# EAGLE design diffren amp (EAGLE 9.5.2)
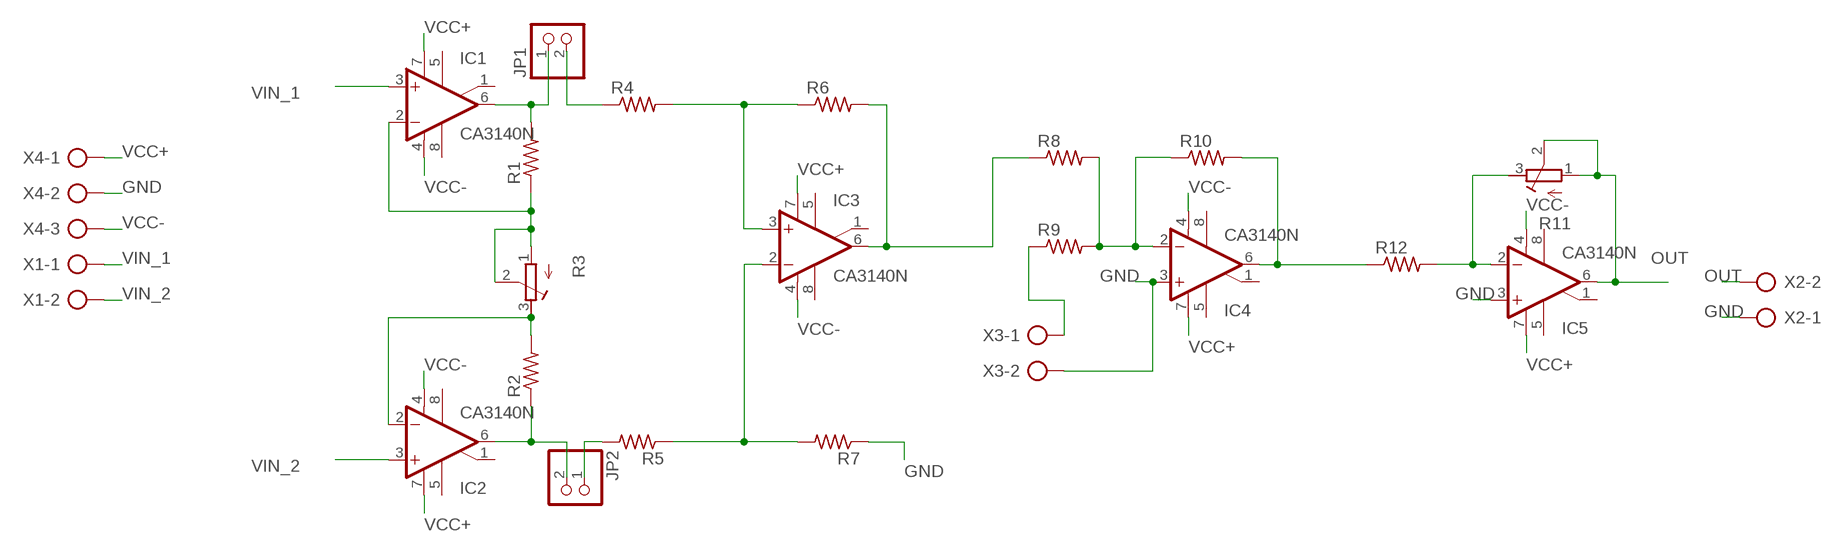
[diagram p0: schematic, sheet 1]

## Parts
IC1  CA3140N  [DIL08]
IC2  CA3140N  [DIL08]
IC3  CA3140N  [DIL08]
IC4  CA3140N  [DIL08]
IC5  CA3140N  [DIL08]
JP1  PINHD-1X2  [1X02]
JP2  PINHD-1X2  [1X02]
R1  R-US_0309/12  [0309/12]
R2  R-US_0309/12  [0309/12]
R3  R-TRIMM64W  [RTRIM64W]
R4  R-US_0309/12  [0309/12]
R5  R-US_0309/12  [0309/12]
R6  R-US_0309/12  [0309/12]
R7  R-US_0309/12  [0309/12]
R8  R-US_0309/12  [0309/12]
R9  R-US_0309/12  [0309/12]
R10  R-US_0309/12  [0309/12]
R11  R-TRIMM64W  [RTRIM64W]
R12  R-US_0309/12  [0309/12]
X1  AK300/2  [AK300/2]
X2  AK500/2-H  [AK500/2-H]
X3  AK500/2-H  [AK500/2-H]
X4  AK300/3  [AK300/3]

## Nets
GND: IC4.3(+IN) IC5.3(+IN) R7.1 X2.1 X3.2 X4.2
N$1: IC1.6(OUT) JP1.1 R1.2
N$2: IC2.6(OUT) JP2.2 R2.1
N$3: IC2.2(-IN) R2.2 R3.3(E)
N$4: IC1.2(-IN) R1.1 R3.1(A) R3.2(S)
N$5: IC3.2(-IN) R5.1 R7.2
N$6: IC3.3(+IN) R4.2 R6.1
N$7: JP1.2 R4.1
N$8: JP2.1 R5.2
N$9: IC4.2(-IN) R8.2 R9.2 R10.1
N$10: IC4.6(OUT) R10.2 R12.1
N$11: R9.1 X3.1
N$12: IC5.2(-IN) R11.3(E) R12.2
OUT: IC3.6(OUT) IC5.6(OUT) R6.2 R8.1 R11.1(A) R11.2(S) X2.2
VCC+: IC1.7(V+) IC2.7(V+) IC3.7(V+) IC4.7(V+) IC5.7(V+) X4.1
VCC-: IC1.4(V-) IC2.4(V-) IC3.4(V-) IC4.4(V-) IC5.4(V-) X4.3
VIN_1: IC1.3(+IN) X1.1
VIN_2: IC2.3(+IN) X1.2
Unconnected: IC1.1(ON/CMP) IC1.5(ON) IC1.8(CMP) IC2.1(ON/CMP) IC2.5(ON) IC2.8(CMP) IC3.1(ON/CMP) IC3.5(ON) IC3.8(CMP) IC4.1(ON/CMP) IC4.5(ON) IC4.8(CMP) IC5.1(ON/CMP) IC5.5(ON) IC5.8(CMP)

## Library data of the parts
IC1-IC5 = linear:CA3140: OP AMP
JP1 JP2 = pinhead:PINHD-1X2: PIN HEADER
R1 R2 R4-R10 R12 = rcl:R-US_: RESISTOR, American symbol; SPICEPREFIX: R
R3 R11 = rcl:R-TRIMM: Trimm resistor; SPICEMODEL: X; SPICEPREFIXL: POT
X1 = con-ptr500:AK300/2: CONNECTOR; OC_FARNELL: unknown; OC_NEWARK: unknown
X2 X3 = con-ptr500:AK500/2-H: CONNECTOR Aug. 2004 / PTR Meßtechnik: Die Bezeichnung der Serie AK505 wurde geändert. Es handelt sich hierbei um AK500 in horizontaler Ausführung.; OC_FARNELL: unknown; OC_NEWARK: unknown
X4 = con-ptr500:AK300/3: CONNECTOR; OC_FARNELL: unknown; OC_NEWARK: unknown

## Board
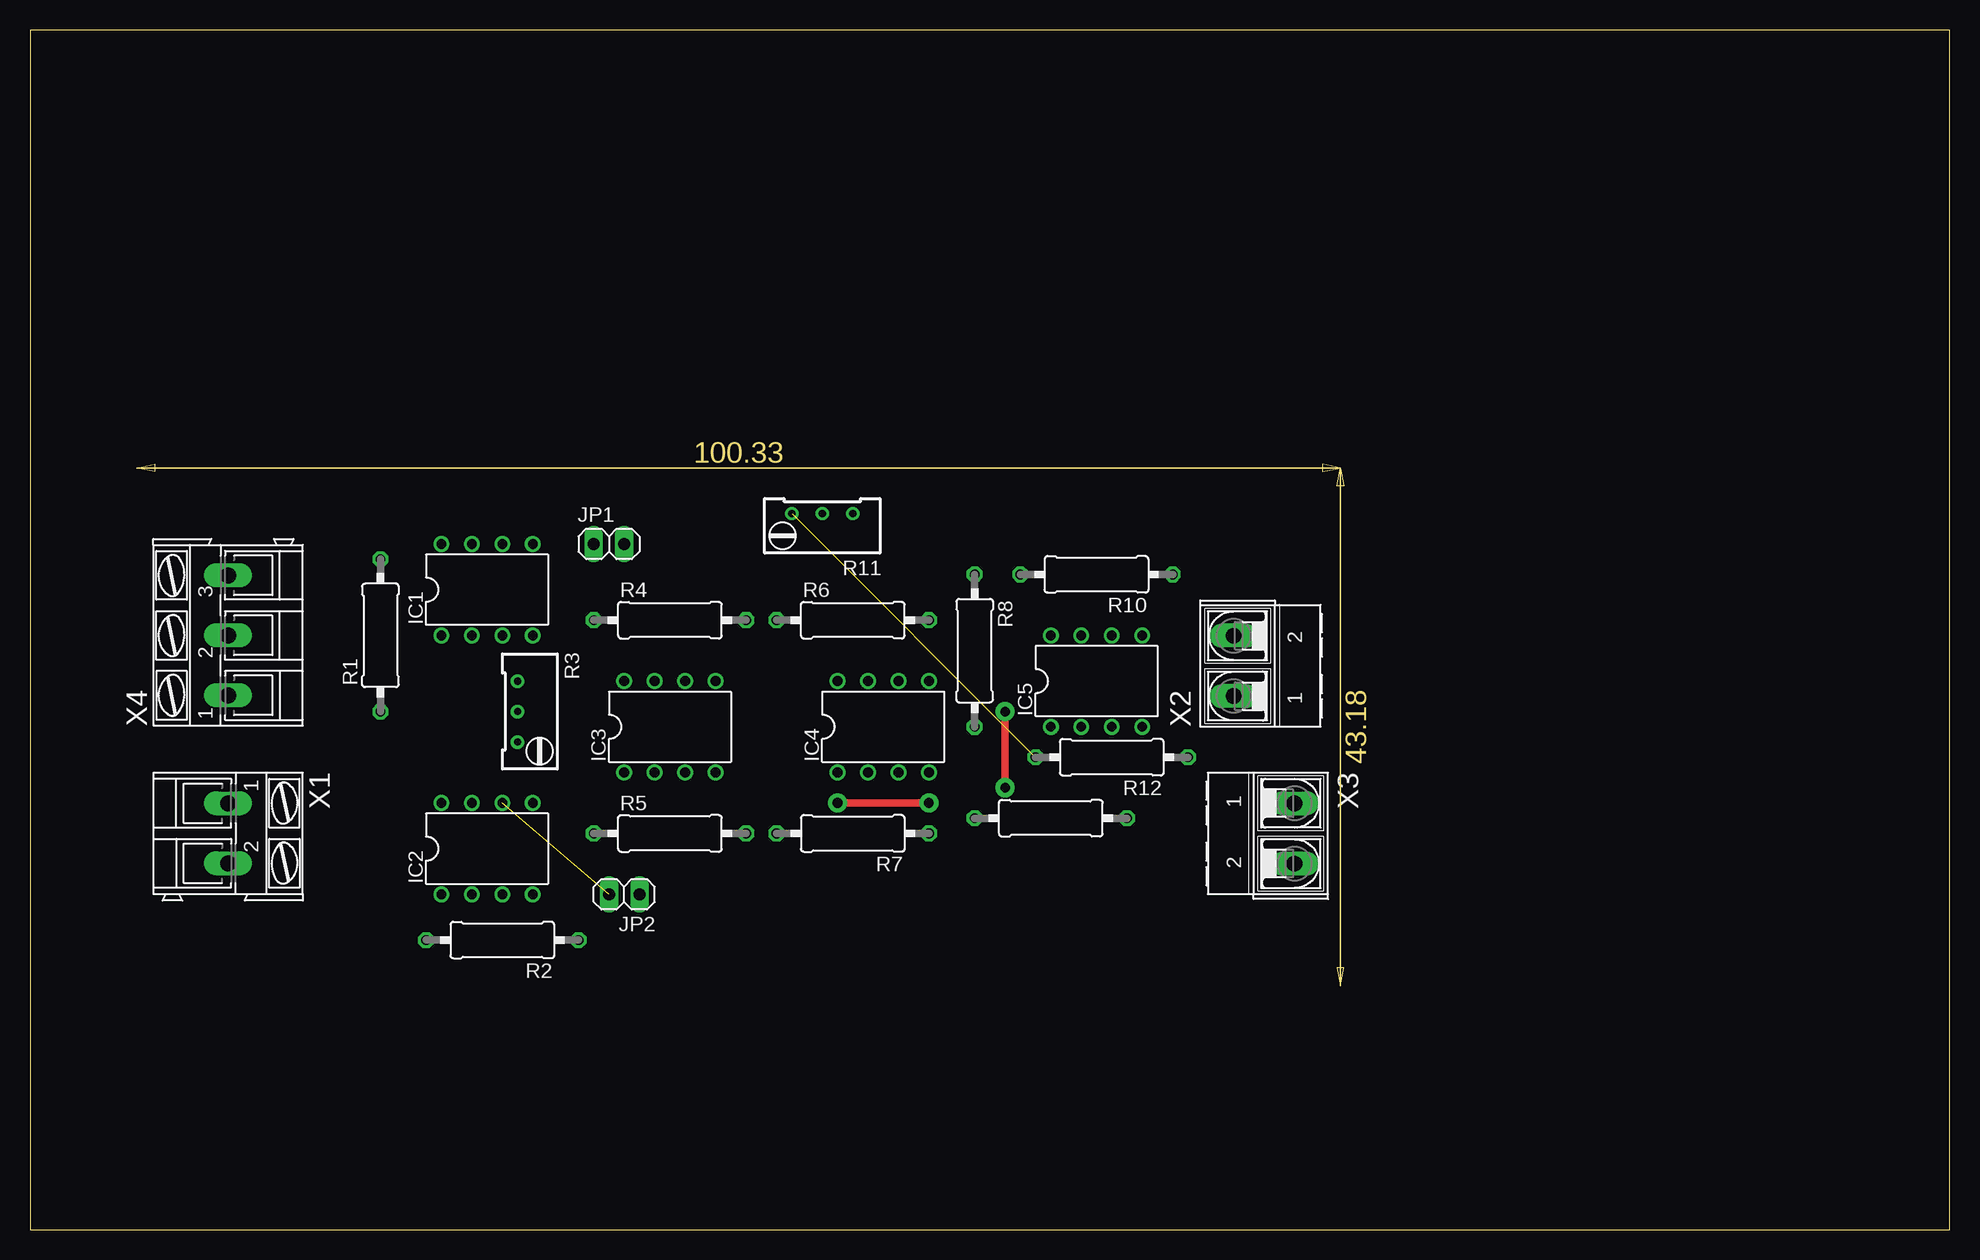
[diagram p1: board, top side]
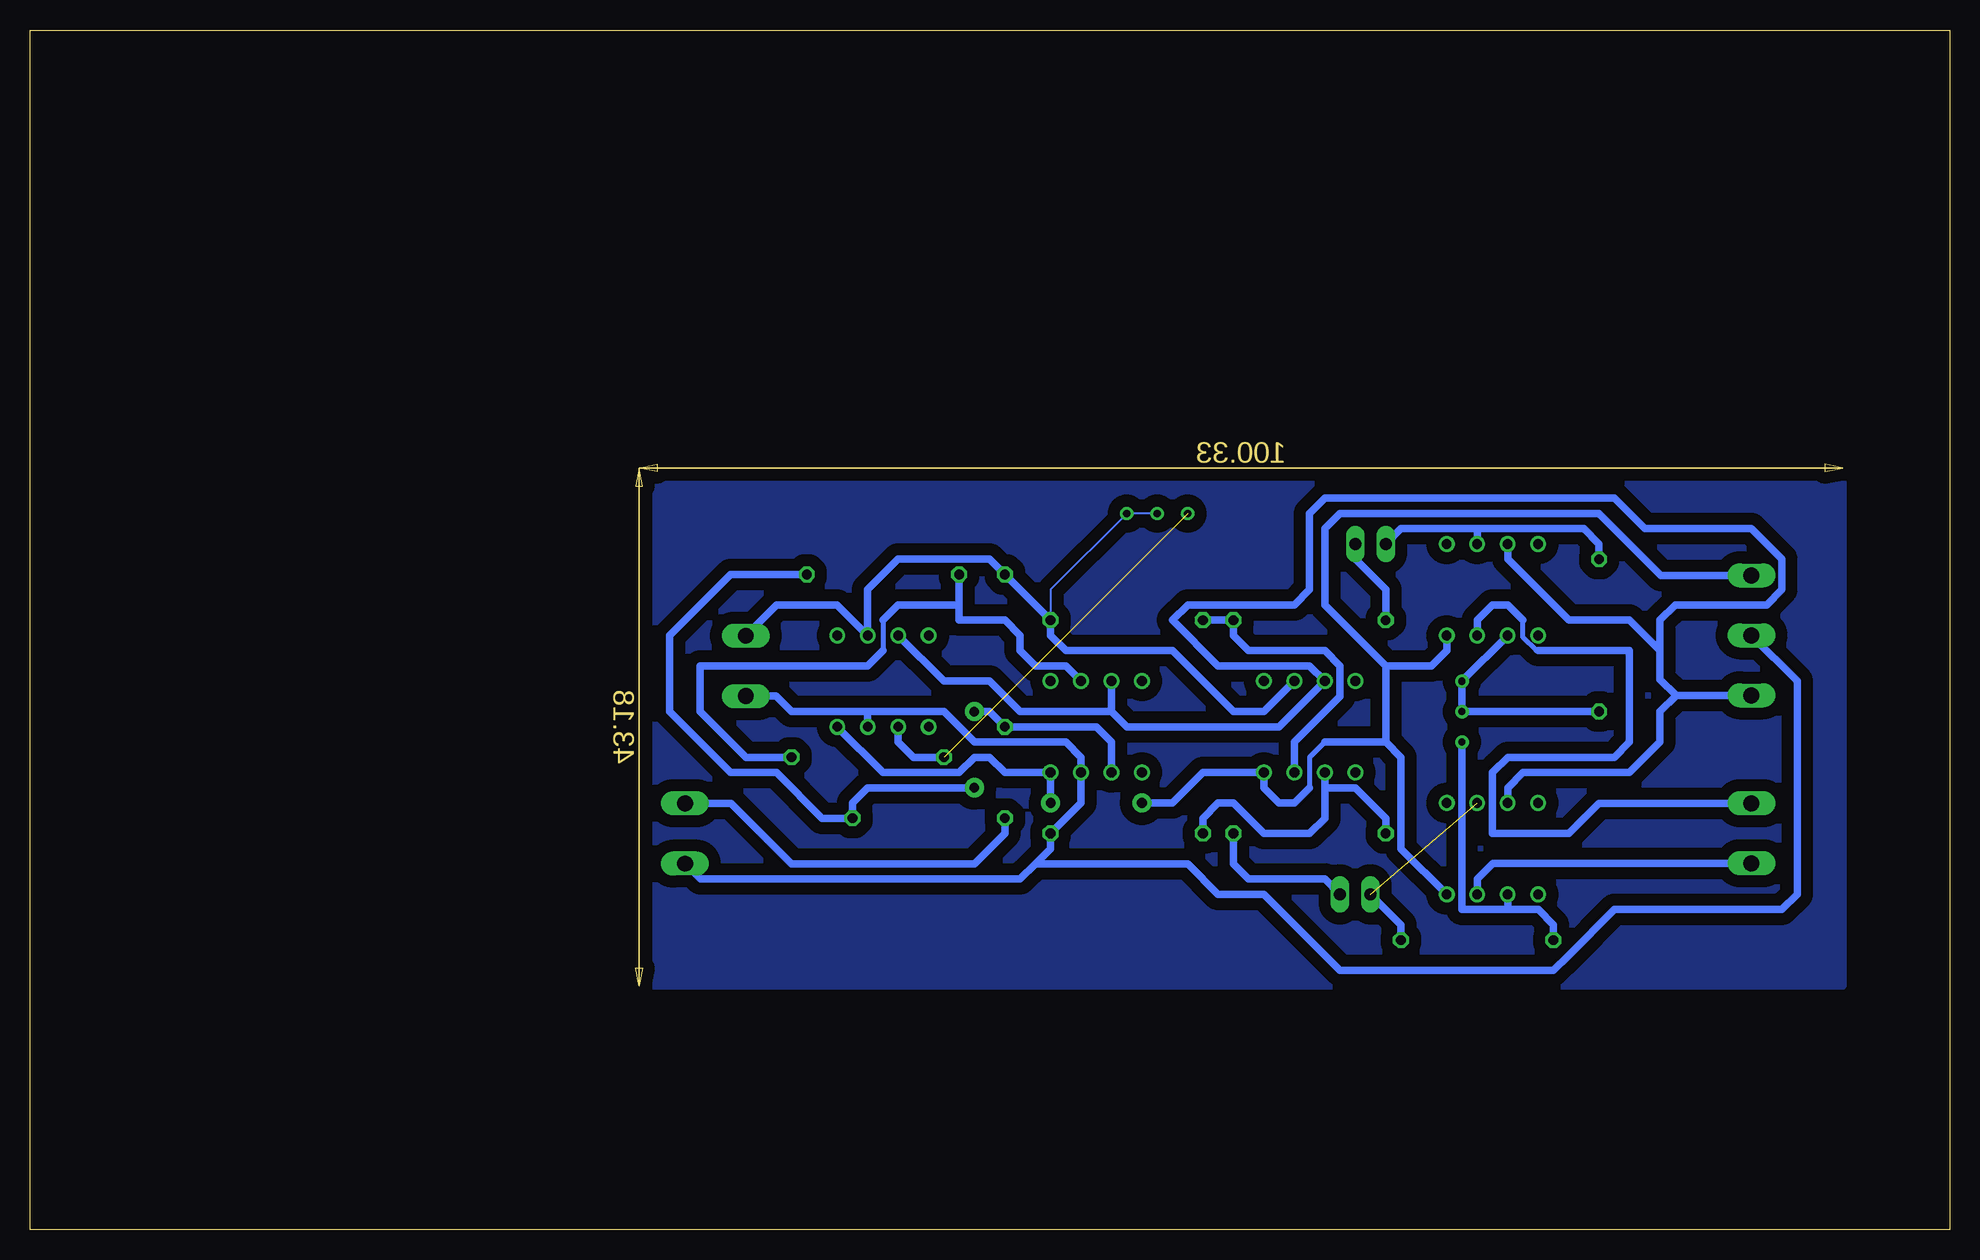
[diagram p2: board, bottom side, seen from below]

Size 160 x 100 mm. Coordinates in mm from the lower left corner, seen from the top.
Outline: 0,0 160,0 160,100 0,100 0,0
Copper layers (1*16): Top 0.035mm / dielectric 1.5mm / Bottom 0.035mm
Design rules "default": minimum track width 6mil, minimum drill 0.35mm, track to track 6mil, track to pad 6mil, pad to pad 6mil, via to via 6mil, smd to smd 6mil, copper to edge 40mil, drill to drill 6mil, minimum pad ring 10mil, minimum via ring 8mil, stop-mask expansion 4mil, vias tented up to drill 0mil, thermal gap 10mil

### Footprints (pad centres in the part's own frame; a part is rotated, then mirrored left to right if it is on the bottom)
DIL08 = drill 0.813 pad 1.27: 1 -3.81,-3.81; 2 -1.27,-3.81; 3 1.27,-3.81; 4 3.81,-3.81; 5 3.81,3.81; 6 1.27,3.81; 7 -1.27,3.81; 8 -3.81,3.81
1X02 = drill 1.016 long: 1 -1.27,0; 2 1.27,0
0309/12 = drill 0.813 octagon: 1 -6.35,0; 2 6.35,0
RTRIM64W = drill 0.61: 1 1.27,-2.54; 2 1.27,0; 3 1.27,2.54
AK300/2 = drill 1.321 long: 1 -2.515,0; 2 2.489,0
AK500/2-H = drill 1.321 long: 1 -2.515,0; 2 2.515,0
AK300/3 = drill 1.321 long: 1 -5.004,0; 2 0,0; 3 5.004,0

### Placement (x,y rotation side)
IC1  38.1,53.34 0 top
IC2  38.1,31.75 0 top
IC3  53.34,41.91 0 top
IC4  71.12,41.91 0 top
IC5  88.9,45.72 0 top
JP1  48.26,57.15 0 top
JP2  49.53,27.94 180 top
R1  29.21,49.53 90 top
R2  39.37,24.13 180 top
R3  41.91,43.18 180 top
R4  53.34,50.8 0 top
R5  53.34,33.02 0 top
R6  68.58,50.8 0 top
R7  68.58,33.02 180 top
R8  78.74,48.26 270 top
R9  85.09,34.29 0 top
R10  88.9,54.61 180 top
R11  66.04,58.42 90 top
R12  90.17,39.37 180 top
X1  16.51,33.02 270 top
X2  100.33,46.99 90 top
X3  105.41,33.02 270 top
X4  16.51,49.53 90 top

### Tracks (layer width: path | path; a pad name or v marks a point on that pad's centre or on a via)
GND
  Bottom 0.61: 90.17,43.18 83.82,43.18 81.28,40.64 73.66,40.64 72.39,39.37 IC4.3 72.39,35.56 R7.1 74.93,31.75 76.2,30.48 | X4.2 12.7,45.72 12.7,27.94 13.97,26.67 27.94,26.67 31.75,22.86 33.02,21.59 50.8,21.59 57.15,27.94 60.96,27.94 63.5,30.48 76.2,30.48 | 90.17,43.18 96.52,43.18 97.81,44.48 X2.1 | IC5.3 90.17,43.18 | X3.2 104.11,29.21 77.47,29.21 76.2,30.48
N$1
  Bottom 0.61: R1.2 29.21,57.15 30.48,58.42 39.37,58.42 | JP1.1 45.72,58.42 39.37,58.42 | IC1.6 39.37,58.42
N$2  (1 unrouted)
  Bottom 0.61: R2.1 45.72,25.4 JP2.2
N$3
  Bottom 0.61: R3.3 40.64,26.67 36.83,26.67 | R2.2 33.02,25.4 34.29,26.67 36.83,26.67 | IC2.2 36.83,26.67
N$4
  Bottom 0.61: IC1.2 R3.1 R3.2 R1.1
N$5
  Bottom 0.61: R5.1 46.99,34.29 49.53,36.83 52.07,36.83 | 52.07,36.83 IC3.2 | 52.07,36.83 52.07,34.29 53.34,33.02 57.15,33.02 59.69,35.56 60.96,35.56 62.23,34.29 R7.2
N$6
  Bottom 0.61: IC3.3 54.61,40.64 50.8,44.45 50.8,46.99 52.07,48.26 58.42,48.26 59.69,49.53 R4.2 R6.1
N$7
  Bottom 0.61: R4.1 46.99,53.34 49.53,55.88 JP1.2
N$8
  Bottom 0.61: JP2.1 52.07,29.21 58.42,29.21 59.69,30.48 R5.2
N$9  (via drill 0.8 pad 1.6)
  Top 0.61: v81.28,36.83 v81.28,43.18
  Bottom 0.61: IC4.2 69.85,40.64 71.12,41.91 R8.2 80.01,43.18 v81.28,43.18 | R10.1 101.6,54.61 106.68,49.53 106.68,43.18 101.6,38.1 97.79,38.1 93.98,34.29 R9.2 91.44,35.56 90.17,36.83 v81.28,36.83
N$10
  Bottom 0.406: 88.9,50.8 88.9,48.26
  Bottom 0.61: IC4.6 73.66,46.99 76.2,46.99 77.47,48.26 77.47,49.53 78.74,50.8 82.55,50.8 82.55,52.07 | 88.9,50.8 87.63,52.07 82.55,52.07 | 88.9,48.26 90.17,46.99 104.14,46.99 104.14,43.18 100.33,39.37 R12.1 | 82.55,52.07 R10.2
N$11
  Bottom 0.61: R9.1 78.74,33.02 81.28,30.48 96.52,30.48 101.58,35.53 X3.1
N$12  (1 unrouted)
  Bottom 0.61: IC5.2 87.63,40.64 86.36,39.37 R12.2
OUT
  Bottom 0.152: R6.2 74.93,53.34 R11.1 R11.2
  Bottom 0.61: IC3.6 57.15,43.18 59.69,43.18 64.77,48.26 73.66,48.26 74.93,49.53 R6.2 R8.1 80.01,55.88 87.63,55.88 90.17,53.34 IC5.6 92.71,52.07 97.77,52.07 X2.2
UPIL
  pour Bottom (isolate 1.016): 8.89,63.5 109.22,63.5 109.22,20.32 8.89,20.32
VCC+
  Bottom 0.61: 69.85,43.18 68.58,41.91 55.88,41.91 IC3.7 53.34,46.99 60.96,46.99 64.77,50.8 63.5,52.07 54.61,52.07 53.34,53.34 53.34,59.69 52.07,60.96 27.94,60.96 25.4,58.42 16.51,58.42 13.97,55.88 13.97,53.34 15.24,52.07 22.86,52.07 24.13,50.8 24.13,48.26 | IC2.7 36.83,36.83 35.56,38.1 26.67,38.1 24.13,40.64 24.13,43.18 22.78,44.53 | X4.1 22.78,44.53 | 22.78,44.53 24.13,45.87 24.13,48.26 | 24.13,48.26 26.67,50.8 31.75,50.8 36.83,55.88 IC1.7 | IC5.7 83.82,45.72 80.01,45.72 77.47,43.18 69.85,43.18 | 69.85,43.18 IC4.7
VCC-  (via drill 0.8 pad 1.6)
  Top 0.61: v67.31,35.56 v74.93,35.56
  Bottom 0.406: 52.07,40.64 53.34,39.37 53.34,36.83
  Bottom 0.61: IC5.4 88.9,38.1 82.55,38.1 81.28,39.37 80.01,39.37 78.74,38.1 IC4.4 v74.93,35.56 | X4.3 24.05,54.53 29.21,59.69 50.8,59.69 52.07,58.42 52.07,52.07 46.99,46.99 | IC1.4 41.91,48.26 43.18,46.99 46.99,46.99 | 53.34,36.83 54.61,35.56 55.88,35.56 57.15,36.83 IC3.4 62.23,38.1 64.77,35.56 v67.31,35.56 | 46.99,40.64 45.72,39.37 45.72,31.75 IC2.4 | 46.99,40.64 52.07,40.64 | 46.99,46.99 46.99,40.64
VIN_1
  Bottom 0.406: 34.29,48.26 34.46,48.26 35.56,49.36 35.56,50.8
  Bottom 0.61: X1.1 29.23,35.53 31.75,33.02 38.1,33.02 38.1,38.1 36.83,39.37 27.94,39.37 26.67,40.64 26.67,48.26 34.29,48.26 | 35.56,50.8 36.83,52.07 38.1,52.07 39.37,50.8 IC1.3
VIN_2
  Bottom 0.61: X1.2 38.05,30.53 39.37,29.21 IC2.3